# Altium schematic sheet jlink-ob.SchDoc
size A4
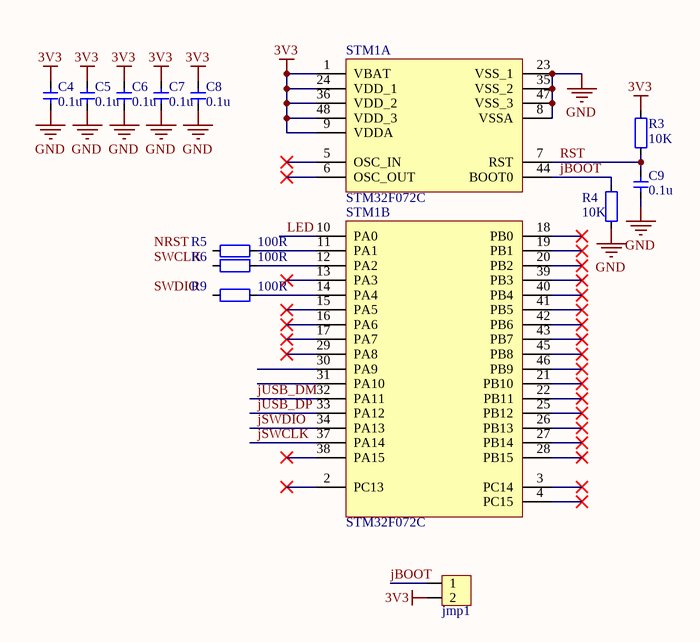
[diagram p0: jlink-ob.SchDoc]

## Parts
C4  value 0.1u  [CAP_0603]  (hidden comment: Cap_0603)
C5  value 0.1u  [CAP_0603]  (hidden comment: Cap_0603)
C6  value 0.1u  [CAP_0603]  (hidden comment: Cap_0603)
C7  value 0.1u  [CAP_0603]  (hidden comment: Cap_0603)
C8  value 0.1u  [CAP_0603]  (hidden comment: Cap_0603)
C9  value 0.1u  [CAP_0603]  (hidden comment: Cap_0603)
jmp1  HDR1x2_2.54  [HDR1X2_2.54_180]  (value not drawn)
R3  value 10K  [RES_0603]  (hidden comment: Res_0603)
R4  value 10K  [RES_0603]  (hidden comment: Res_0603)
R5  value 100R  [RES_0603]  (hidden comment: Res_0603)
R6  value 100R  [RES_0603]  (hidden comment: Res_0603)
R9  value 100R  [RES_0603]  (hidden comment: Res_0603)
STM1  STM32F072C  [LQFP_P0.5_48]  (parts A,B of 2)

## Nets
3V3: C4.1 C5.1 C6.1 C7.1 C8.2 jmp1.2 R3.2 STM1.1(VBAT) STM1.9(VDDA) STM1.24(VDD_1) STM1.36(VDD_2) STM1.48(VDD_3)
GND: C4.2 C5.2 C6.2 C7.2 C8.1 C9.1 R4.1 STM1.8(VSSA) STM1.23(VSS_1) STM1.35(VSS_2) STM1.47(VSS_3)
jBOOT: jmp1.1 R4.2 STM1.44(BOOT0)
jSWCLK: STM1.37(PA14)
jSWDIO: STM1.34(PA13)
jUSB_DM: STM1.32(PA11)
jUSB_DP: STM1.33(PA12)
LED: STM1.10(PA0)
RST: C9.2 R3.1 STM1.7(RST)
NetR5_2: R5.2 STM1.11(PA1)
NetR6_2: R6.2 STM1.12(PA2)
NetR9_2: R9.2 STM1.14(PA4)

Not connected (* = marked no-connect by the designer): R5 1; R6 1; R9 1; STM1 2(PC13)* 3(PC14)* 4(PC15)* 5(OSC_IN)* 6(OSC_OUT)* 13(PA3)* 15(PA5)* 16(PA6)* 17(PA7)* 18(PB0)* 19(PB1)* 20(PB2)* 21(PB10)* 22(PB11)* 25(PB12)* 26(PB13)* 27(PB14)* 28(PB15)* 29(PA8)* 30(PA9) 31(PA10) 38(PA15)* 39(PB3)* 40(PB4)* 41(PB5)* 42(PB6)* 43(PB7)* 45(PB8)* 46(PB9)*

## Notes on the sheet
- Labels drawn without touching a wire or pin: NRST, SWCLK, SWDIO

## Library data of the parts
C4-C9 = Cap_0603: Capacitor
jmp1 = HDR1x2_2.54: Header
R3-R6 R9 = Res_0603: Resistor
STM1 = STM32F103C: MCU